# EAGLE schematic interface (EAGLE 5.01)
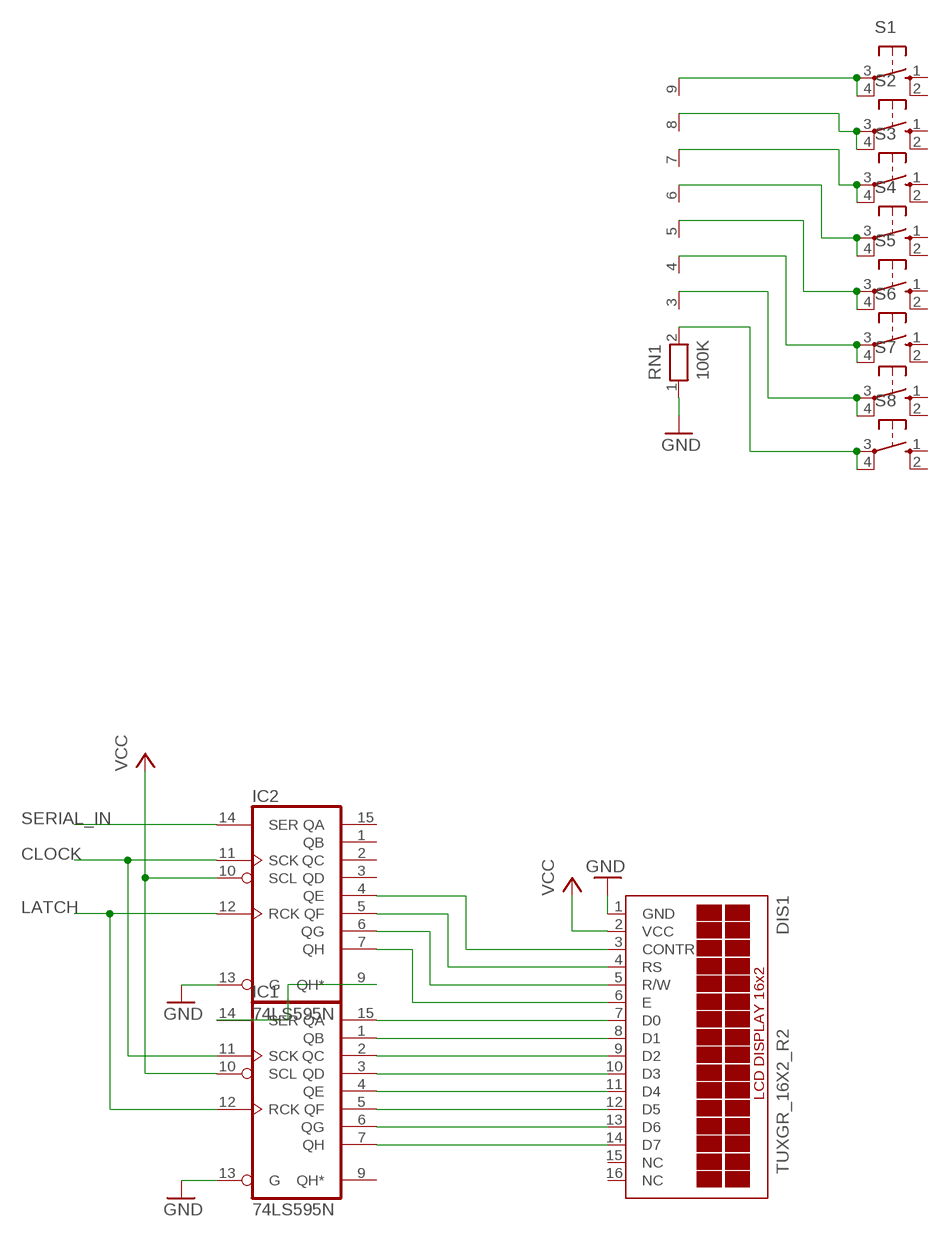
[diagram p0: schematic, sheet 1]

## Parts
DIS1  TUXGR_16X2_R2  [TUXGR_16X2_R2]
IC1  74LS595N  [DIL16]
IC2  74LS595N  [DIL16]
RN1  100K  RN08  [RN-9]
S1  10-XX  [B3F-10XX]
S2  10-XX  [B3F-10XX]
S3  10-XX  [B3F-10XX]
S4  10-XX  [B3F-10XX]
S5  10-XX  [B3F-10XX]
S6  10-XX  [B3F-10XX]
S7  10-XX  [B3F-10XX]
S8  10-XX  [B3F-10XX]

## Nets
CLOCK: IC1.11(SCK) IC2.11(SCK)
GND: DIS1.1(GND) IC1.13(G) IC2.13(G) RN1.1
LATCH: IC1.12(RCK) IC2.12(RCK)
N$1: DIS1.7(D0) IC1.15(QA)
N$2: DIS1.8(D1) IC1.1(QB)
N$3: DIS1.9(D2) IC1.2(QC)
N$4: DIS1.10(D3) IC1.3(QD)
N$5: DIS1.11(D4) IC1.4(QE)
N$6: DIS1.12(D5) IC1.5(QF)
N$7: DIS1.13(D6) IC1.6(QG)
N$8: DIS1.14(D7) IC1.7(QH)
N$9: DIS1.6(E) IC2.7(QH)
N$10: DIS1.5(R/W) IC2.6(QG)
N$11: DIS1.4(RS) IC2.5(QF)
N$12: DIS1.3(CONTR) IC2.4(QE)
N$13: IC1.14(SER) IC2.9(QH*)
N$14: RN1.9 S1.3(P) S1.4(P1)
N$15: RN1.8 S2.3(P) S2.4(P1)
N$16: RN1.7 S3.3(P) S3.4(P1)
N$17: RN1.6 S4.3(P) S4.4(P1)
N$18: RN1.5 S5.3(P) S5.4(P1)
N$19: RN1.4 S6.3(P) S6.4(P1)
N$20: RN1.3 S7.3(P) S7.4(P1)
N$21: RN1.2 S8.3(P) S8.4(P1)
SERIAL_IN: IC2.14(SER)
VCC: DIS1.2(VCC) IC1.10(SCL) IC2.10(SCL)
Unconnected: DIS1.15(NC) DIS1.16(NC) IC1.9(QH*) IC2.1(QB) IC2.2(QC) IC2.3(QD) IC2.15(QA) S1.1(S) S1.2(S1) S2.1(S) S2.2(S1) S3.1(S) S3.2(S1) S4.1(S) S4.2(S1) S5.1(S) S5.2(S1) S6.1(S) S6.2(S1) S7.1(S) S7.2(S1) S8.1(S) S8.2(S1)

## Power pins joined to a net without a drawn wire
GND: IC1.8(GND) IC2.8(GND)
VCC: IC1.16(VCC) IC2.16(VCC)

## Library data of the parts
DIS1 = display-lcd:TUXGR_16X2_R2: Tuxgraphics LCD display 16x2 characters reflective, without background light Source: tuxgr_12x2_r2.pdf
IC1 IC2 = 74xx-us:74*595: 8-bit SHIFT REGISTER, output latch
RN1 = resistor-net:RN08: RESISTOR NETWORK
S1-S8 = switch-omron:10-XX: OMRON SWITCH